# EAGLE design LCD&ControlRev2 (EAGLE 9.2.2)
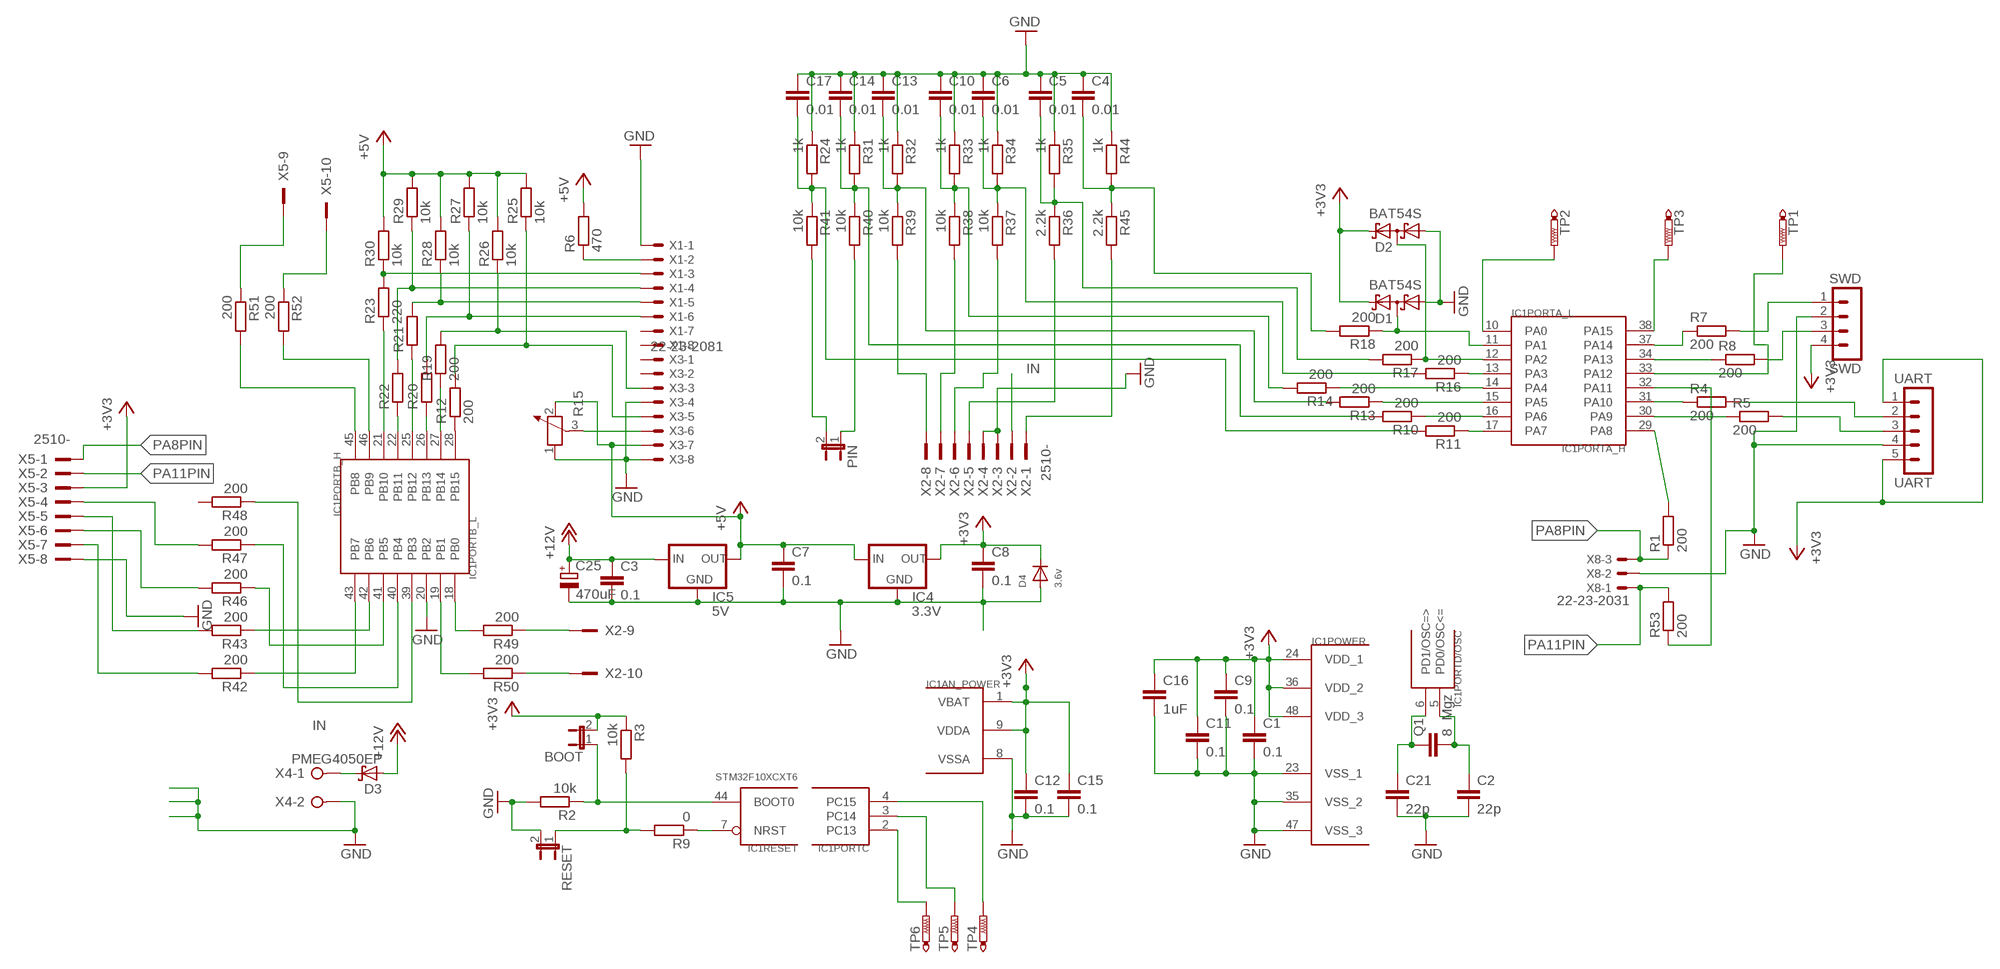
[diagram p0: schematic, sheet 1]

## Parts
BOOT  JP1E  [JP1]
C1  0.1  C-EUC0402  [C0402]
C2  22p  C-EUC0603  [C0603]
C3  0.1  C-EUC1206  [C1206]
C4  0.01  C-EUC0603  [C0603]
C5  0.01  C-EUC0603  [C0603]
C6  0.01  C-EUC0603  [C0603]
C7  0.1  C-EUC1206  [C1206]
C8  0.1  C-EUC1206  [C1206]
C9  0.1  C-EUC0402  [C0402]
C10  0.01  C-EUC0603  [C0603]
C11  0.1  C-EUC0402  [C0402]
C12  0.1  C-EUC0402  [C0402]
C13  0.01  C-EUC0603  [C0603]
C14  0.01  C-EUC0603  [C0603]
C15  0.1  C-EUC0402  [C0402]
C16  1uF  C-EUC0603  [C0603]
C17  0.01  C-EUC0603  [C0603]
C21  22p  C-EUC0603  [C0603]
C25  470uF  CPOL-EUE5-10.5  [E5-10,5]
D1  BAT54S  [SOT23]
D2  BAT54S  [SOT23]
D3  PMEG4050EP  [SOD128]
D4  3.6v  DIODESOD-123  [SOD-123]
IC1  STM32F10XCXT6  [TQFP48]
IC4  3.3V  LM1117  [SOT223]
IC5  5V  LM1117  [SOT223]
PIN  JP1E  [JP1]
Q1  8 Mgz  C-EU050-024X044  [C050-024X044]
R1  200  R-EU_R0603  [R0603]
R2  10k  R-EU_R0603  [R0603]
R3  10k  R-EU_R0603  [R0603]
R4  200  R-EU_R0603  [R0603]
R5  200  R-EU_R0603  [R0603]
R6  470  R-EU_R0603  [R0603]
R7  200  R-EU_R0603  [R0603]
R8  200  R-EU_R0603  [R0603]
R9  0  R-EU_M1206  [M1206]
R10  200  R-EU_R0603  [R0603]
R11  200  R-EU_R0603  [R0603]
R12  200  R-EU_R0603  [R0603]
R13  200  R-EU_R0603  [R0603]
R14  200  R-EU_R0603  [R0603]
R15  POTENTIOMETER_PT-10S  [PT-10S]
R16  200  R-EU_R0603  [R0603]
R17  200  R-EU_R0603  [R0603]
R18  200  R-EU_R0603  [R0603]
R19  200  R-EU_R0603  [R0603]
R20  R-EU_R0603  [R0603]
R21  R-EU_R0603  [R0603]
R22  R-EU_R0603  [R0603]
R23  220  R-EU_R0603  [R0603]
R24  1k  R-EU_R0603  [R0603]
R25  10k  R-EU_R0603  [R0603]
R26  10k  R-EU_R0603  [R0603]
R27  10k  R-EU_R0603  [R0603]
R28  10k  R-EU_R0603  [R0603]
R29  10k  R-EU_R0603  [R0603]
R30  10k  R-EU_R0603  [R0603]
R31  1k  R-EU_R0603  [R0603]
R32  1k  R-EU_R0603  [R0603]
R33  1k  R-EU_R0603  [R0603]
R34  1k  R-EU_R0603  [R0603]
R35  1k  R-EU_R0603  [R0603]
R36  2.2k  R-EU_R0603  [R0603]
R37  10k  R-EU_R0603  [R0603]
R38  10k  R-EU_R0603  [R0603]
R39  10k  R-EU_R0603  [R0603]
R40  10k  R-EU_R0603  [R0603]
R41  10k  R-EU_R0603  [R0603]
R42  200  R-EU_R0603  [R0603]
R43  200  R-EU_R0603  [R0603]
R44  1k  R-EU_R0603  [R0603]
R45  2.2k  R-EU_R0603  [R0603]
R46  200  R-EU_R0603  [R0603]
R47  200  R-EU_R0603  [R0603]
R48  200  R-EU_R0603  [R0603]
R49  200  R-EU_R0603  [R0603]
R50  200  R-EU_R0603  [R0603]
R51  200  R-EU_R0603  [R0603]
R52  200  R-EU_R0603  [R0603]
R53  200  R-EU_R0603  [R0603]
RESET  JP1E  [JP1]
SWD  SWD  MA04-1  [MA04-1]
TP1  PTR1TP06R  [TP06R]
TP2  PTR1TP06R  [TP06R]
TP3  PTR1TP06R  [TP06R]
TP4  PTR1TP06R  [TP06R]
TP5  PTR1TP06R  [TP06R]
TP6  PTR1TP06R  [TP06R]
UART  UART  MA05-1  [MA05-1]
X1  22-23-2081  [22-23-2081]
X2  2510-  [PAK100/2500-10]
X3  22-23-2081  [22-23-2081]
X4  W237-02P  [W237-132]
X5  2510-  [PAK100/2500-10]
X8  22-23-2031  [22-23-2031]

## Nets
+3V3: BOOT.2 C1.1 C8.1 C9.1 C11.1 C12.1 C15.1 C16.1 D1.2(C2) D2.2(C2) D4.C IC1.1(AN_POWER:VBAT) IC1.9(AN_POWER:VDDA) IC1.24(POWER:VDD_1) IC1.36(POWER:VDD_2) IC1.48(POWER:VDD_3) IC4.2(OUT) IC4.4(OUT) R3.1 SWD.4 UART.1 UART.5 X5.3
+5V: C7.1 IC4.3(IN) IC5.2(OUT) IC5.4(OUT) R6.2 R15.2 R25.2 R26.2 R27.2 R28.2 R29.2 R30.2 X3.7
+12V: C3.1 C25.+ D3.2(A) IC5.3(IN)
GND: C1.2 C2.2 C3.2 C4.1 C5.1 C6.1 C7.2 C8.2 C9.2 C10.1 C11.2 C12.2 C13.1 C14.1 C15.2 C16.2 C17.1 C21.2 C25.- D1.1(A1) D2.1(A1) D4.A IC1.8(AN_POWER:VSSA) IC1.20(PORTB_L:PB2) IC1.23(POWER:VSS_1) IC1.35(POWER:VSS_2) IC1.47(POWER:VSS_3) IC4.1(GND) IC5.1(GND) R2.2 R15.1 R24.1 R31.1 R32.1 R33.1 R34.1 R35.1 R44.1 RESET.2 SWD.2 UART.4 X1.1 X2.3 X2.4 X3.4 X3.8 X4.2 X5.8 X8.2
IN: D3.1(K) X2.2 X4.1
N$1: IC1.29(PORTA_H:PA8) R1.2
N$3: C21.1 IC1.6(PORTD/OSC:PD1/OSC=>) Q1.1
N$4: C2.1 IC1.5(PORTD/OSC:PD0/OSC<=) Q1.2
N$5: IC1.37(PORTA_H:PA14) R7.1
N$6: IC1.34(PORTA_H:PA13) R8.1
N$7: R7.2 SWD.1
N$8: R3.2 R9.2 RESET.1
N$9: IC1.7(RESET:NRST) R9.1
N$10: IC1.31(PORTA_H:PA10) R4.1
N$11: IC1.30(PORTA_H:PA9) R5.1
N$12: R4.2 UART.2
N$13: R6.1 X1.2
N$17: R15.3 X3.6
N$21: R49.1 X2.9
N$22: R22.2 R29.1 X1.4
N$23: C17.2 R11.2 R24.2 R41.1
N$24: R52.1 X5.10
N$26: IC1.33(PORTA_H:PA12) TP1.TP
N$27: IC1.46(PORTB_H:PB9) R52.2
N$29: R43.2 X5.5
N$30: R21.2 R28.1 X1.5
N$31: D1.3(C1A2) IC1.11(PORTA_L:PA1) R18.1
N$32: R20.2 R27.1 X1.6
N$33: R19.2 R26.1 X3.3
N$34: R23.2 R30.1 X1.3
N$35: R12.2 R25.1 X3.5
N$36: IC1.21(PORTB_H:PB10) R23.1
N$37: IC1.22(PORTB_H:PB11) R22.1
N$38: IC1.25(PORTB_H:PB12) R21.1
N$44: IC1.45(PORTB_H:PB8) R51.2
N$67: IC1.10(PORTA_L:PA0) TP2.TP
N$69: R5.2 UART.3
N$73: R46.2 X5.6
N$78: R47.2 X5.4
N$79: R51.1 X5.9
N$105: IC1.28(PORTB_H:PB15) R12.1
N$107: R8.2 SWD.3
N$109: IC1.18(PORTB_L:PB0) R49.2
N$112: IC1.43(PORTB_L:PB7) R42.1
N$113: D2.3(C1A2) IC1.12(PORTA_L:PA2) R17.1
N$115: BOOT.1 IC1.44(RESET:BOOT0) R2.1
N$117: R42.2 X5.7
N$123: IC1.42(PORTB_L:PB6) R43.1
N$127: C14.2 R10.2 R31.2 R40.1
N$129: C13.2 R13.2 R32.2 R39.1
N$130: R38.2 X2.7
N$131: IC1.13(PORTA_L:PA3) R16.1
N$132: IC1.19(PORTB_L:PB1) R50.2
N$134: IC1.14(PORTA_L:PA4) R14.1
N$135: C6.2 R16.2 R34.2 R37.1
N$138: C5.2 R17.2 R35.2 R36.1
N$140: IC1.26(PORTB_H:PB13) R20.1
N$141: IC1.27(PORTB_H:PB14) R19.1
N$142: R50.1 X2.10
N$143: IC1.38(PORTA_H:PA15) TP3.TP
N$160: IC1.15(PORTA_L:PA5) R13.1
N$162: IC1.16(PORTA_L:PA6) R10.1
N$164: R45.2 X2.1
N$165: IC1.41(PORTB_L:PB5) R46.1
N$169: IC1.17(PORTA_L:PA7) R11.1
N$170: IC1.2(PORTC:PC13) TP6.TP
N$171: IC1.40(PORTB_L:PB4) R47.1
N$172: IC1.39(PORTB_L:PB3) R48.1
N$173: C4.2 R18.2 R44.2 R45.1
N$174: R36.2 X2.5
N$175: R37.2 X2.6
N$176: IC1.3(PORTC:PC14) TP5.TP
N$177: IC1.32(PORTA_H:PA11) R53.1
N$178: C10.2 R14.2 R33.2 R38.1
N$179: R39.2 X2.8
N$180: IC1.4(PORTC:PC15) TP4.TP
N$184: PIN.1 R40.2
N$199: PIN.2 R41.2
PA8PIN: R1.1 X5.1 X8.3
PA11PIN: R53.2 X5.2 X8.1
Unconnected: R48.2 X1.7 X1.8 X3.1 X3.2

## Library data of the parts
BOOT PIN RESET = jumper:JP1E: JUMPER
C1-C3 C7-C9 C11 C12 C15 C16 C21 Q1 = rcl:C-EU: CAPACITOR, European symbol
C4-C6 C10 C13 C14 C17 = rcl:C-EU: CAPACITOR, European symbol; SPICEPREFIX: C
C25 = rcl:CPOL-EU: POLARIZED CAPACITOR, European symbol
D1 D2 = diode:BAT54S: Schottky Diodes Pin connection corrected 2011-05-04 Source: Fairchild .. BAT54.pdf
D3 = nxp_60:PMEG4050E: 40 V, 5 A low VF MEGA Schottky barrier rectifier Planar Maximum Efficiency General Application (MEGA) Schottky barrier rectifier with an integrated guard ring for stress protection. AAL Eindhoven MK
D4 = adafruit:DIODE: Diode SMADIODE - SMA Surface Mount Package 20V 1A Schottky Diode Digikey: 641-1014-6-ND DO-1N4148 - Through Hole Small Current Diode SOD-123 20V 1 A (.5mV Vf) Schottky Diode - Digikey: MBRX120TPMSCT-ND SOD-323 10V 570mA (.38mV Vf, 3ns) Schottky Diode - Digikey: ZLLS410CT-ND SOD-523 30V 30mA Schottky Diode (RB751S-40TE61) - Digikey: RB751S-40TE61CT-ND SOT23-R/W - SOT23 Package (R = Solder Paste/Reflow Ovens, W = Hand-Soldering) BAT54Film 40V 300mA - Digikey: 497-7162-1-ND
IC1 = stm32(1):STM32F10XCXT6: ST STM32F101/103 48pin LQFP
IC4 IC5 = v-reg-2:LM1117
R1-R14 R16-R34 R36-R53 = rcl:R-EU_: RESISTOR, European symbol
R15 = rcl:POTENTIOMETER_: Potentiometer
R35 = rcl:R-EU_: RESISTOR, European symbol; SPICEPREFIX: R
SWD = con-lstb:MA04-1: PIN HEADER; OC_FARNELL: unknown; OC_NEWARK: unknown
TP1-TP6 = testpad:PTR1: TEST PIN
UART = con-lstb:MA05-1: PIN HEADER; OC_FARNELL: unknown; OC_NEWARK: unknown
X1 X3 = con-molex:22-23-2081: .100" (2.54mm) Center Header - 8 Pin; MF: MOLEX; MPN: 22-23-2081; OC_FARNELL: 1756826; OC_NEWARK: 01C7592
X2 X5 = con-3m:2510-: 3M (TM) Pak 100 4-Wall Header Source: 3M; MF: 3M; MPN: 2510-6002UB; OC_FARNELL: 9838244; OC_NEWARK: 46F4725
X4 = con-wago-508:W237-02P: WAGO SREW CLAMP; OC_FARNELL: unknown; OC_NEWARK: unknown
X8 = con-molex:22-23-2031: .100" (2.54mm) Center Header - 3 Pin; MF: MOLEX; MPN: 22-23-2031; OC_FARNELL: 1462950; OC_NEWARK: 30C0862

## Board
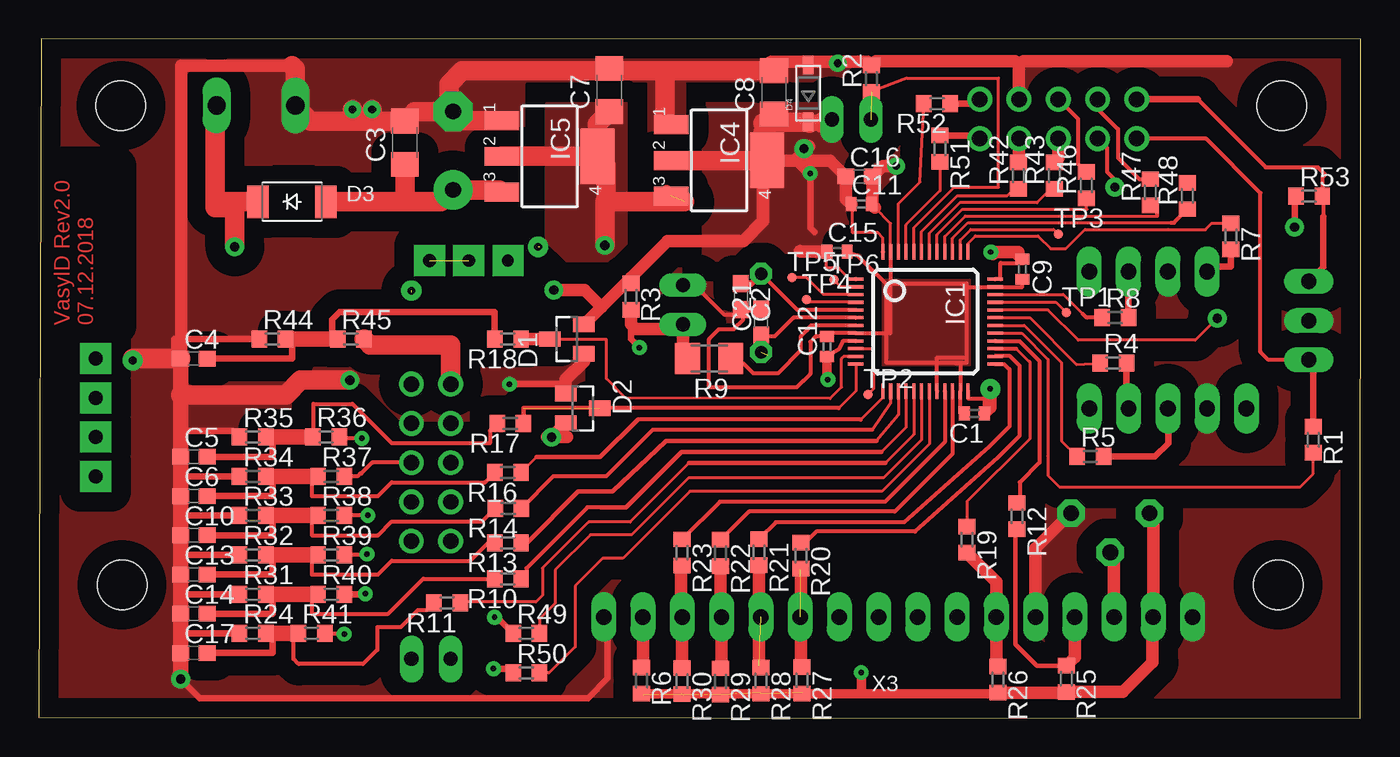
[diagram p1: board, top side]
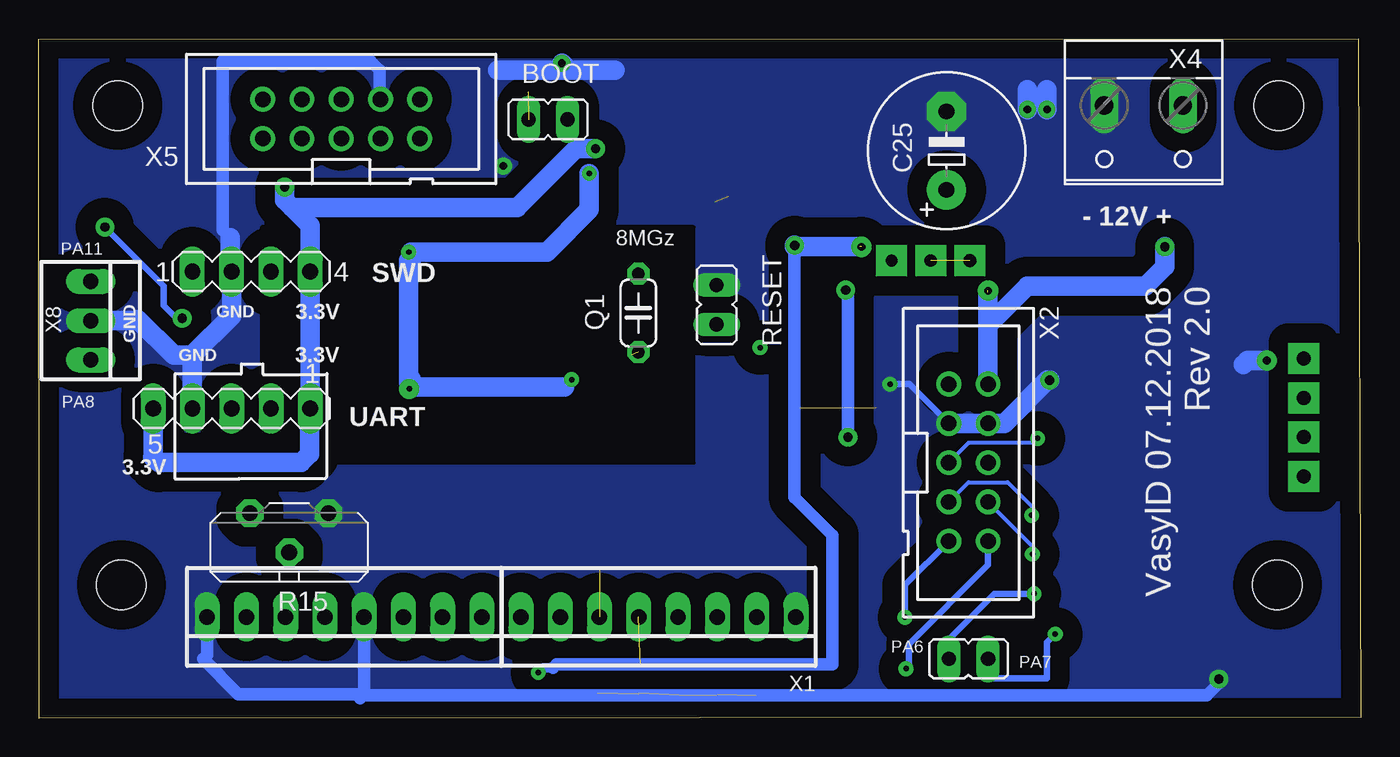
[diagram p2: board, bottom side, seen from below]

Size 85.55 x 43.99 mm. Coordinates in mm from the lower left corner, seen from the top.
Outline: 0,0.06 85.51,0 85.55,43.96 0.17,43.99 0,0.06
Copper layers (1*16): Top 0.035mm / dielectric 1.5mm / Bottom 0.035mm
Design rules "DRC LCD part *": minimum track width 7mil, minimum drill 0.35mm, track to track 9mil, track to pad 10mil, pad to pad 12mil, via to via 12mil, smd to smd 2mil, copper to edge 40mil, drill to drill 40mil, minimum pad ring 12mil, minimum via ring 12mil, stop-mask expansion 4mil, vias tented up to drill 0mil, thermal gap 10mil
Holes 3.2 mm at 5.4,8.64 5.32,39.65 80.44,39.66 80.2,8.64

### Footprints (pad centres in the part's own frame; a part is rotated, then mirrored left to right if it is on the bottom)
JP1 = drill 0.914 long: 1 0,-1.27; 2 0,1.27
C0402 = smd 0.7 x 0.9: 1 -0.65,0; 2 0.65,0
C0603 = smd 1.1 x 1: 1 -0.85,0; 2 0.85,0
C1206 = smd 1.6 x 1.8: 1 -1.4,0; 2 1.4,0
E5-10,5 = drill 1.016 pad 2.54: + -2.54,0 | drill 1.016 pad 2.54 octagon: - 2.54,0
SOT23 = smd 1 x 1.4: 1 -0.95,-1.1; 2 0.95,-1.1; 3 0,1.1
SOD128 = smd 1.4 x 2.1: 1 -2.2,0; 2 2.2,0
SOD-123 = smd 1.2 x 0.7: A 1.85,0; C -1.85,0
TQFP48 = smd 0.2 x 1: 1 -2.75,-4.5; 2 -2.25,-4.5; 3 -1.75,-4.5; 4 -1.25,-4.5; 5 -0.75,-4.5; 6 -0.25,-4.5; 7 0.25,-4.5; 8 0.75,-4.5; 9 1.25,-4.5; 10 1.75,-4.5; 11 2.25,-4.5; 12 2.75,-4.5; 25 2.75,4.5; 26 2.25,4.5; 27 1.75,4.5; 28 1.25,4.5; 29 0.75,4.5; 30 0.25,4.5; 31 -0.25,4.5; 32 -0.75,4.5; 33 -1.25,4.5; 34 -1.75,4.5; 35 -2.25,4.5; 36 -2.75,4.5 | smd 1 x 0.2: 13 4.5,-2.75; 14 4.5,-2.25; 15 4.5,-1.75; 16 4.5,-1.25; 17 4.5,-0.75; 18 4.5,-0.25; 19 4.5,0.25; 20 4.5,0.75; 21 4.5,1.25; 22 4.5,1.75; 23 4.5,2.25; 24 4.5,2.75; 37 -4.5,2.75; 38 -4.5,2.25; 39 -4.5,1.75; 40 -4.5,1.25; 41 -4.5,0.75; 42 -4.5,0.25; 43 -4.5,-0.25; 44 -4.5,-0.75; 45 -4.5,-1.25; 46 -4.5,-1.75; 47 -4.5,-2.25; 48 -4.5,-2.75
SOT223 = smd 1.219 x 2.235: 1 -2.311,-3.099; 2 0,-3.099; 3 2.311,-3.099 | smd 3.6 x 2.2: 4 0,3.099
C050-024X044 = drill 0.813 octagon: 1 -2.54,0; 2 2.54,0
R0603 = smd 1 x 1.1: 1 -0.85,0; 2 0.85,0
M1206 = smd 1.6 x 2: 1 -1.4,0; 2 1.4,0
PT-10S = drill 1.016 pad 1.778 octagon: 1 -2.54,-1.27; 2 2.54,-1.27; 3 0,1.27
MA04-1 = drill 1.016 long: 1 -3.81,0; 2 -1.27,0; 3 1.27,0; 4 3.81,0
TP06R = smd 0.6 x 0.6: TP 0,0
MA05-1 = drill 1.016 long: 1 -5.08,0; 2 -2.54,0; 3 0,0; 4 2.54,0; 5 5.08,0
22-23-2081 = drill 1 long: 1 -8.89,0; 2 -6.35,0; 3 -3.81,0; 4 -1.27,0; 5 1.27,0; 6 3.81,0; 7 6.35,0; 8 8.89,0
PAK100/2500-10 = drill 1 pad 1.422: 1 -5.08,-1.27; 2 -5.08,1.27; 3 -2.54,-1.27; 4 -2.54,1.27; 5 0,-1.27; 6 0,1.27; 7 2.54,-1.27; 8 2.54,1.27; 9 5.08,-1.27; 10 5.08,1.27
W237-132 = drill 1.194 long: 1 -2.54,-0.635; 2 2.54,-0.635
22-23-2031 = drill 1 long: 1 -2.54,0; 2 0,0; 3 2.54,0

### Placement (x,y rotation side)
BOOT  52.59,38.76 270 bottom
C1  60.55,19.74 180 top
C2  45.43,27.3 270 top
C3  23.7,37.25 90 top
C4  10.05,23.28 0 top
C5  10.05,16.93 0 top
C6  10.05,14.39 0 top
C7  36.92,40.67 90 top
C8  47.57,40.51 90 top
C9  63.65,29.07 270 top
C10  10.05,11.85 0 top
C11  53.23,33.27 0 top
C12  51,24.06 90 top
C13  10.05,9.31 0 top
C14  10.05,6.77 0 top
C15  51.66,30.2 0 top
C16  53.1,35.06 0 top
C17  10.05,4.23 0 top
C21  46.75,25.65 90 top
C25  26.81,36.74 90 bottom
D1  34.18,24.55 90 top
D2  35.2,20.07 270 top
D3  16.4,33.44 0 top
D4  49.8,40.45 90 top
IC1  57.38,25.68 270 top
IC4  44.03,36.11 270 top
IC5  33.06,36.37 270 top
PIN  25.39,3.85 270 bottom
Q1  46.75,26.24 90 bottom
R1  82.47,18.03 270 top
R2  53.89,41.4 90 top
R3  38.32,27.29 270 top
R4  69.53,23.01 0 top
R5  68.05,16.94 0 top
R6  39.01,2.45 270 top
R7  77.15,31.19 270 top
R8  69.66,25.95 0 top
R9  43.38,23.28 180 top
R10  30.37,9.03 180 top
R11  26.43,7.47 180 top
R12  63.31,13.09 270 top
R13  30.37,11.37 180 top
R14  30.39,13.6 180 top
R15  69.34,12.01 180 bottom
R16  30.37,15.91 180 top
R17  30.52,19.09 180 top
R18  30.37,24.55 180 top
R19  60.07,11.57 270 top
R20  49.31,10.53 270 top
R21  46.62,10.76 270 top
R22  44.13,10.71 270 top
R23  41.64,10.73 270 top
R24  13.86,5.5 0 top
R25  66.5,2.57 270 top
R26  62.08,2.51 270 top
R27  49.4,2.46 270 top
R28  46.75,2.44 270 top
R29  44.13,2.39 270 top
R30  41.63,2.41 270 top
R31  13.86,8.04 0 top
R32  13.86,10.58 0 top
R33  13.86,13.12 0 top
R34  13.86,15.66 0 top
R35  13.86,18.2 0 top
R36  18.61,18.22 0 top
R37  18.94,15.66 0 top
R38  18.94,13.12 0 top
R39  18.94,10.58 0 top
R40  18.94,8.04 0 top
R41  17.67,5.5 0 top
R42  63.39,35.13 90 top
R43  65.71,35.13 90 top
R44  15.13,24.55 0 top
R45  20.21,24.55 0 top
R46  67.78,34.51 90 top
R47  71.95,34.05 90 top
R48  74.33,33.81 90 top
R49  31.56,5.5 0 top
R50  31.56,2.93 0 top
R51  58.33,36.87 270 top
R52  58.13,39.79 180 top
R53  82.21,33.79 0 top
RESET  41.68,26.77 0 bottom
SWD  71.79,28.92 0 bottom
TP1  66.48,26.25 0 top
TP2  53.66,20.97 0 top
TP3  65.98,31.36 0 top
TP4  49.67,27.11 0 top
TP5  48.73,28.54 0 top
TP6  51.47,28.38 0 top
UART  73.06,20.05 180 bottom
X1  45.45,6.57 180 bottom
X2  25.39,16.55 270 bottom
X3  65.77,6.57 180 bottom
X4  14.06,39.03 180 bottom
X5  65.98,38.8 0 bottom
X8  82.18,25.74 270 bottom

### Tracks (layer width: path | path; a pad name or v marks a point on that pad's centre or on a via)
+3V3  (via drill 0.35, 0.35 pad 1.3, 0.6)
  Top 0.203: IC1.48 54.63,31.1 54.29,31.43 52.67,31.43 52.67,33.18 C11.1 | IC1.1 52.47,28.43 51.75,29.15 50.97,29.15 50.97,30.15 C15.1
  Top 0.254: IC1.24 60.14,21.18 60.14,20.71 61.2,20.71 C1.1 | IC1.36 62.24,28.43 62.24,29.48 63.65,29.48 C9.1 | IC1.48 | 52.87,28.44 IC1.1 | 52.88,24.41 IC1.9 52.86,24.41 52.03,24.41 51.78,23.9 C12.1 | X5.3 69.13,36.92 69.13,35.37 69.69,34.81 69.69,34.43 v69.63,34.38 | SWD.4 67.98,30.34
  Top 0.406: v61.61,30.18 61.74,30.04 61.75,30.04 | 50.2,31.46 49.92,31.74 v49.92,35.27
  Top 0.61: 49.09,36.11 48.15,36.11 | C12.1 51,21.98 v51.07,21.92
  Top 0.813: C1.1 61.57,20.11 v61.57,21.32 | 49.99,38.41 D4.C | 35.45,25.67 arc-90 D1.2 36.41,26.63 | D2.2 v33.19,18.2 | v33.19,18.2 32.91,18.2 | v33.19,18.2 34.18,18.2 | C11.1 52.25,33.6 C16.1 51.21,36.11 49.09,36.11 v49.92,35.27 | 48.15,36.11 IC4.4 48.91,36.11 49.85,37.05 49.7,37.05 v49.52,36.87 | 36.41,26.63 38.32,28.54 | 38.32,28.54 40.68,30.9 45.61,30.9 46.88,32.17 46.88,35.98 | v33.34,27.72 35.32,27.72 36.41,26.63 | R3.1 38.32,28.54 | C9.1 63.4,29.97 63.4,30.19 61.89,30.19 61.74,30.04 | C15.1 49.3,30.2 49.26,30.24
  Top 1.27: 46.91,37.96 46.88,37.92 47.13,37.67 IC4.4 IC4.2 | 50.69,38.58 50.69,38.52 | 49.88,38.52 D4.C 46.96,38.6 46.88,38.52
  Bottom 0.406: v61.57,21.32 61.76,21.51 61.61,21.73 | 61.44,29.4 61.61,29.57 61.61,29.63
  Bottom 0.813: v51.07,21.92 51.54,21.45 | v33.19,18.2 33.19,27.57 v33.34,27.72 | 61.53,21.88 61.53,21.45 61.53,21.36 v61.57,21.32 | v61.61,30.18 61.61,29.63
  Bottom 1.27: 51.54,21.45 61.53,21.45 | 61.44,21.97 61.53,21.88 | 61.44,29.4 61.44,30.19 52.67,30.19 49.92,32.93 v49.92,35.27 | 61.61,29.63 61.61,21.73 | v49.52,36.87 50.79,36.87 54.6,33.06 69.15,33.06 | 69.63,34.33 v69.63,34.38 69.63,33.54 69.15,33.06 | 69.15,33.06 67.98,31.89 SWD.4 UART.1 68.01,20.03 68.01,17.11 68.57,16.55 77.79,16.55 78.14,16.9 | 78.14,16.9 78.17,16.93 | UART.5 78.14,16.9
  pour Top (isolate 1.27, no thermals): 43.07,39.79 55.77,39.79 55.77,29.63 43.07,29.63
+5V  (via drill 0.35, 0.5 pad 1.3, 0.6)  (6 unrouted)
  Top 0.61: 64.66,1.67 64.59,1.6 53.23,1.6 | R6.2 53.23,1.6 | 53.23,1.6 v53.23,2.96
  Top 0.813: 41.71,1.49 R30.2 | 46.7,1.64 R28.2 | 49.38,1.64 R27.2 | R26.2 64.66,1.67 66.45,1.67 R25.2 70.17,1.72 72.07,3.62 72.07,6.52 X3.7 72.12,13.04 R15.2 | 39.13,1.49 R6.2 | IC4.3 40.61,34.11
  Top 1.27: IC5.2 IC5.4 | IC5.4 36.16,38.5 C7.1 | IC5.4 36.72,35.81 36.72,33.44 | 36.72,33.44 36.64,33.44 v36.64,30.62 | 36.72,33.44 41.8,33.44
  Bottom 0.61: v53.23,2.96 52.92,3.26 52.26,3.26
  Bottom 0.813: v36.64,30.62 36.64,14.31 34.18,11.85 34.18,3.49 52.03,3.49 52.26,3.26
  Bottom 1.27: v36.64,30.62 36.64,30.52 32.41,30.52
  other vias: 32.32,30.52
  pour Top (isolate 1.27, no thermals): 32.91,39.79 37.99,39.79 37.99,29.63 34.18,29.63 32.91,30.9
+12V
  Top 1.27: D3.2 23.51,33.44 | 23.51,33.44 26.05,33.44 C25.+ 29.82,34.2 IC5.3 | C3.1 23.7,33.63 23.51,33.44
GND  (via drill 0.35, 0.5, 0.5 pad 1.3, 0.6)
  Top 0.203: IC1.47 55.13,32.02 54.1,33.05 C11.2
  Top 0.254: IC1.47 55.13,28.17 55.22,28.17 55.22,28.14 60.05,28.14 60.05,27.93 | 60.05,27.93 60.05,23.34 | 60.05,23.34 60.05,23.01 59.64,23.01 | 59.33,23.01 54.86,23.01 54.86,24.87 | 54.86,24.87 54.86,28.09 | 54.86,28.09 55.09,28.09 55.09,24.93 | 60.05,27.93 IC1.35 63.65,27.93 C9.2 | 59.56,23.01 59.33,23.01 | 59.33,23.01 59.33,22.99 59.56,22.99 59.56,23.01 | 59.56,23.01 59.64,23.01 | 59.64,23.01 59.64,21.18 IC1.23 59.63,19.74 C1.2 | IC1.20 58.13,23.34 60.05,23.34 | IC1.47 | IC1.47 | 54.86,24.87 54.8,24.93 IC1.8 51.05,24.93 C12.2 50.28,24.71 49.93,24.37 49.93,22.29 49.5,21.86 49.47,21.86 49.03,21.43 43.38,21.43 43.38,24.55 44.02,25.18 44.97,25.18 45.61,25.82 45.61,26.28 C2.2 45.12,26.14 44.34,26.14 42.43,28.04 | C15.2 53,29.96 54.86,28.09 | 54.22,35.41 C16.2
  Top 0.406: R31.1 9.2,8.04 | R24.1 9.2,5.5 | R32.1 9.2,10.58 | R44.1 8.78,24.55 8.78,23.7 C4.1 | v9.2,2.54 10.43,1.31 35.55,1.31 36.82,2.58 36.82,6.31 X1.1 | R35.1 12.6,18.61 9.2,18.61 | R34.1 9.22,15.66 9.2,15.63 | R33.1 9.32,13.12 9.2,13.25 | v30.47,21.63 34.1,21.63 | C2.2 46.69,26.45 C21.2 | RESET.2 42.43,28.04
  Top 0.61: C16.2 53.88,34.99
  Top 0.813: 16.4,42.26 9.21,42.23 9.21,23.29 C4.1 | D1.1 35.28,23.11 34.1,21.94 34.1,21.63 D2.1 | C8.2 47.57,42.24 47.36,42.46 47.41,42.51 52.06,42.51 | 52.06,42.51 53.63,42.51 R2.2 54.18,42.54 63.16,42.54 63.44,42.26 | 54.1,33.05 53.95,33.2 C16.2 54.63,35.75 v55.49,35.75 | X3.4 64.5,10.99 R15.1 | 63.44,42.26 X5.8 | 63.44,42.26 63.71,42.54 66.03,42.54 | 66.03,42.54 66.13,42.54 | 66.03,42.54 76.87,42.54 | 52.06,42.51 51.95,42.4 v51.7,42.4
  Top 1.016: C4.1 9.2,20.94 9.2,18.61 9.2,15.63 9.2,13.25 9.2,10.58 9.2,8.04 9.2,5.5 C17.1 v9.2,2.54
  Top 1.27: 47.53,41.87 C8.2 40.53,41.91 | C7.2 36.94,42.09 | 40.53,41.91 27.41,41.91 26.56,41.06 26.56,39.54 C25.- | IC4.1 40.53,38.82 40.53,41.91 | v20.13,21.88 16.95,21.88 16.01,20.94 9.2,20.94 | IC5.1 27.41,38.68 C25.- | C25.- 24.33,39.28 C3.2 21.58,38.65 | 21.58,38.65 20.31,38.65 | 20.31,38.65 17.61,38.65 X4.2 16.6,42.05 16.4,42.26 | 20.31,38.65 v20.31,39.41 | 21.58,38.65 v21.58,39.41 | C4.1 6.08,23.28 v6.08,23.15
  Bottom 0.406: X2.3 29.2,21.63 v30.47,21.63
  Bottom 0.813: X5.8 63.49,40.12 63.49,41.95 64.08,42.54 73.65,42.54 73.65,31.79 | 73.65,31.79 | 73.65,31.79 73.65,31.61 73.16,31.13 | v9.2,2.54 9.2,2.26 9.98,1.48 10.15,1.48 64.59,1.48 | 64.59,1.48 64.76,1.31 | 64.59,1.48 64.5,1.56 | 64.5,1.56 X3.4 | 64.5,1.56 72.63,1.56 74.92,3.85 74.66,4.1 X3.8 | v51.7,42.4 52.06,42.04 52.06,41.95
  Bottom 1.27: X2.3 X2.4 23.08,19.09 20.28,21.88 v20.13,21.88 | 73.16,31.13 73.16,29.02 SWD.2 73.06,26.05 75.6,23.51 | X8.2 79.21,25.74 79.13,25.82 76.82,23.51 75.6,23.51 | v20.31,39.41 20.31,40.68 | v21.58,39.41 21.58,40.68 | 75.6,23.51 UART.4 | 6.08,23.2 v6.08,23.15 7.35,23.15 7.61,22.9 | v51.7,42.4 51.25,41.95 | 51.25,41.95 48.25,41.95 | 51.25,41.95 55.87,41.95
  pour Top (isolate 0.406, rank 2, no thermals): 54.62,28.36 60.26,28.36 60.26,22.87 54.62,22.87
  pour Top (isolate 1.27, rank 3, no thermals): -0.11,43.6 84.98,43.6 84.98,0.42 -0.11,0.42
  pour Bottom (isolate 1.27, rank 2, no thermals): 0.42,43.98 0.42,43.98 85.59,44.13 85.43,0.04 0.14,0.19 0.14,44.13 0.23,44.08
IN  (via drill 0.5 pad 1.3, 0.6)  (1 unrouted)
  Top 1.27: v12.69,30.52 12.69,33.34 | 12.69,33.34 12.59,33.44 | X4.1 11.42,39.56 11.42,33.06 | D3.1 11.8,33.44 11.42,33.06 | 11.42,33.06 12.41,33.06 12.69,33.34
  Bottom 1.27: X2.2 24.12,25.44 | 24.12,25.44 21.58,27.98 13.96,27.98 12.69,29.25 v12.69,30.52 | 24.12,25.44 24.12,27.59
  other vias: 24.12,27.67
N$1
  Top 0.203: IC1.29 63.62,24.93 65.32,23.23 65.32,16.98 | 65.32,16.98 65.29,16.95 | 65.32,16.98 65.32,15.71 66.04,14.99 81.64,14.99 82.47,15.82 R1.2
N$3  (1 unrouted)
  Top 0.254: IC1.6 48.84,25.93 47.63,24.71 46.84,24.71 C21.1 | 47.19,23.51 47.26,23.45
  Top 0.406: C21.1 Q1.1
N$4
  Top 0.254: IC1.5 49.1,26.43 Q1.2
  Top 0.406: C2.1 46.12,28.15 Q1.2
N$5
  Top 0.203: R7.1 75.91,32.04 75.49,31.62 | 75.48,31.61 75.49,31.62 | IC1.37 60.13,30.74 60.6,31.22 60.62,31.22 64.67,31.22 65.49,30.39 66.46,30.39 67.7,31.64 73.08,31.64 73.09,31.62 75.49,31.62
N$6
  Top 0.203: IC1.34 66.3,27.43 67.55,26.18 67.83,25.9
  Top 0.254: R8.1 67.78,25.95 67.55,26.18
N$7
  Top 0.406: SWD.1 75.93,29.25 77.15,29.25 R7.2
N$8  (via drill 0.35)
  Top 0.254: 41.68,23.17 41.48,22.96 41.67,22.96 R9.2
  Top 0.406: 38.32,25.51 38.32,24.55 v38.87,23.99
  Top 0.813: R9.2 41.68,23.58 41.68,25.03 | 41.68,25.03 RESET.1 | R3.2 38.32,25.51 38.65,25.18 41.53,25.18 41.68,25.03
  Bottom 0.406: v38.87,23.99 39.05,24.17
N$9
  Top 0.254: IC1.7 49.98,25.43 49.73,25.18 49.73,25.13 49.68,25.07 49.66,25.07 49.3,24.71 49.3,23.79 47.83,22.33 46.24,22.33 45.61,22.96 45.1,22.96 R9.1
N$10
  Top 0.203: IC1.31 64.14,25.93 67.16,22.91 R4.1
N$11
  Top 0.203: IC1.30 63.78,25.43 66.18,23.03 66.18,17.96 R5.1
N$12
  Top 0.406: 70.55,22.85 R4.2 70.38,20.19 UART.2
N$13
  Top 0.813: X1.2 39.1,3.39 R6.1
N$15  (via drill 0.8 pad 2, 0.85 pad 2)  (1 unrouted)
  other vias: 27.83,29.63 25.29,29.63
N$17
  Top 0.813: X3.6 69.58,10.5 R15.3
N$21  (via drill 0.35)
  Top 0.406: R49.1 29.67,6.54 v29.5,6.54
  Bottom 0.406: v29.5,6.54 29.5,8.62 X2.9
N$22
  Top 0.813: 44.18,9.81 R22.2 44.13,6.62 X1.4 44.18,3.29 R29.1
N$23
  Top 0.254: 16.4,5.5 16.42,5.5 16.5,5.42 16.5,3.85 16.8,3.54 | R11.2 25.11,7 24.52,7 23.43,5.91 21.91,5.91 21.91,4.43 20.99,3.52 20.97,3.54 16.8,3.54 | 16.83,3.52 16.8,3.54
  Top 0.406: C17.2 15.13,4.23 15.13,5.5
  Top 0.813: R41.1 16.42,5.5
  Top 1.016: R24.2 15.13,5.5 16.42,5.5
N$24
  Top 0.406: R52.1 60.62,39.79 X5.10
N$26
  Top 0.203: IC1.33 65.81,26.93 TP1.TP
N$27
  Top 0.203: IC1.46 55.63,33.3 57.04,34.71 R52.2
N$29
  Top 0.813: R43.2 65.98,36.25 X5.5
N$30  (1 unrouted)
  Top 0.813: 46.72,9.81 R21.2 46.62,3.42 R28.1 46.72,3.31
N$31
  Top 0.203: IC1.11 52.11,23.43 51.96,23.28 51.96,21.44 51.21,20.69 37.99,20.74 36.74,21.98 36.74,24.52 32.45,24.52 32.42,24.55
  Top 0.813: D1.3 32.42,24.55 R18.1
N$32  (1 unrouted)
  Top 0.813: 49.26,9.63 R20.2 49.31,3.5 49.26,3.45 R27.1
N$33
  Top 0.813: R19.2 61.96,8.83 X3.3 61.96,3.48 R26.1
N$34
  Top 0.813: R30.1 41.64,3.28 X1.3 41.57,6.64 41.57,9.81 R23.2
N$35
  Top 0.305: R25.1 64.58,3.42 63.21,4.79 63.21,12.14 R12.2
  Top 0.813: X3.5 67.04,3.96 R25.1
N$36
  Top 0.254: IC1.21 58.63,17.89 54.76,14.02 44.08,14.02 R23.1
N$37
  Top 0.254: IC1.22 59.13,17.12 55.4,13.39 45.96,13.39 R22.1
N$38
  Top 0.254: IC1.25 62.47,22.93 62.81,22.58 62.81,18.9 61.48,17.56 55.99,12.69 47.7,12.69 R21.1
N$44
  Top 0.203: IC1.45 56.13,31.95 58.33,34.15 R51.2
N$67
  Top 0.203: IC1.10 53.92,23.93 54.01,23.84 54.01,21.32 TP2.TP
N$69
  Top 0.406: R5.2 72.24,16.94 73.09,17.79 73.09,20.03 UART.3
N$73
  Top 0.254: X5.6 67.25,38.8 67.25,35.89 R46.2
N$78
  Top 0.254: X5.4 68.52,39.46 69.84,38.14 69.84,36.28 71.22,34.9 R47.2
N$79
  Top 0.406: R51.1 60.71,37.72 X5.9
N$105
  Top 0.254: IC1.28 61.9,24.41 63.46,24.41 64.76,23.11 64.76,16.55 63.49,15.28 63.49,14.12 R12.1
N$107
  Top 0.406: R8.2 70.51,28.9 SWD.3
N$109
  Top 0.203: IC1.18 57.13,18.03 54.67,15.57 42.06,15.57 38.37,11.87 35.7,11.87 33.43,9.6 33.43,7.44 32.41,6.43 R49.2
N$112
  Top 0.203: R42.1 63.13,34.28 62.66,33.81 59.42,33.81 57.13,31.52 IC1.43
N$113  (1 unrouted)
  Top 0.203: IC1.12 52.88,21.18 51.78,20.08
  Top 0.254: 51.78,20.08 31.37,20.08
  Top 0.305: R17.1 31.37,20.08
N$115  (1 unrouted)
  Top 0.203: IC1.44 56.63,31.76 59.25,34.38 62.12,34.38 62.12,41.44 56.18,41.44 R2.1
N$117
  Top 0.813: R42.2 63.44,36.03 X5.7
N$123
  Top 0.203: R43.1 65.51,34.28 64.61,33.38 59.6,33.38 57.63,31.41 IC1.42
N$127
  Top 0.254: R40.1 17.67,8.04 17.67,6.77 22.62,6.77 24.88,9.03 R10.2
  Top 0.406: C14.2 15.13,6.77 15.13,8.04
  Top 1.016: R40.1 15.13,8.04 R31.2
N$129
  Top 0.254: R39.1 17.67,10.16 17.67,9.31 21.96,9.31 22.85,10.2 27.93,10.2 29.1,11.37 R13.2
  Top 0.406: C13.2 15.13,9.31 15.13,10.58
  Top 1.016: R39.1 15.13,10.58 R32.2
N$130  (via drill 0.35)
  Top 0.254: v21.3,13.14 19.81,13.14 R38.2
  Bottom 0.254: X2.7 25.39,15.28 22.85,15.28 21.3,13.73 v21.3,13.14
N$131
  Top 0.203: 54.63,21 IC1.13 54.63,20.77 53.2,19.34 | 32.21,16.9 R16.1
  Top 0.254: 53.2,19.34 38.77,19.34
  Top 0.305: 38.77,19.34 36.33,16.9 32.21,16.9
N$132
  Top 0.203: IC1.19 57.63,17.75 54.57,14.69 42.14,14.69 37.81,10.36 36.5,10.36 34.71,8.57 34.71,4.62 33.02,2.93 R50.2
N$134
  Top 0.203: IC1.14 55.13,20.39 53.95,18.67 | 31.34,13.7 R14.1
  Top 0.254: R14.1 33.3,15.66 36.72,15.66 39.73,18.67 53.95,18.67
N$135
  Top 0.254: R37.1 17.67,15.24 17.67,14.39 21.96,14.39 22.85,15.28 28.88,15.28 R16.2
  Top 0.406: C6.2 15.13,14.39 15.13,15.66
  Top 1.016: R37.1 15.13,15.66 R34.2
N$138
  Top 0.254: 17.67,18.2 17.77,18.2 R36.1 17.77,20.36 20.31,20.36 22.85,17.82 29.2,17.82 29.2,18.62 R17.2
  Top 0.406: C5.2 15.13,16.93 15.13,18.2
  Top 1.016: R36.1 | 17.77,18.2 15.13,18.2 R35.2
N$140
  Top 0.254: R20.1 49.61,11.38 50.32,12.09 56.71,12.09 62.12,16.93 63.49,18.3 63.49,22.81 62.86,23.44 IC1.26
N$141
  Top 0.203: 63.25,23.93 64.07,23.1 64.12,23.1 64.12,18.1 60.07,14.05 R19.1
  Top 0.254: IC1.27 63.25,23.93
N$142  (via drill 0.35)
  Top 0.406: R50.1 30.43,3.21 v29.43,3.21
  Bottom 0.406: v29.43,3.21 29.25,3.39 29.25,4.79 24.12,9.92 X2.10
N$143
  Top 0.203: IC1.38 59.63,30.96 60.31,31.65 65.68,31.65 TP3.TP
N$160
  Top 0.203: IC1.15 55.63,19.62 54.19,17.96
  Top 0.305: 54.19,17.96 40.58,17.96 37.15,14.68 34.91,14.68 31.6,11.37 R13.1
N$162
  Top 0.203: IC1.16 56.13,18.84 54.52,17.23
  Top 0.254: 36.72,13.67 35.51,13.67 31.56,9.72 31.56,9.37 R10.1
  Top 0.305: 36.37,13.67 36.72,13.67 38.01,13.67 41.58,17.23 54.52,17.23
N$164
  Top 1.27: R45.2 21.44,24.17 26.66,24.17 X2.1
N$165
  Top 0.203: R46.1 67.78,33 67.83,32.94 59.78,32.94 58.13,31.3 IC1.41
N$169
  Top 0.203: IC1.17 56.63,18.38 54.79,16.54 | 42.09,16.54 38.27,12.71 35.59,12.71 32.6,9.73 32.6,7.95 32.18,7.53 27.28,7.53 R11.1
  Top 0.305: 54.79,16.54 42.09,16.54
N$170
  Top 0.203: IC1.2 51.93,27.93 TP6.TP
N$171
  Top 0.203: 72.38,32.51 59.96,32.51 58.63,31.19 IC1.40
  Top 0.254: 72.38,32.51 72.38,32.77 R47.1
N$172
  Top 0.203: IC1.39 59.13,31.07 60.13,32.08 73.28,32.08
  Top 0.254: 73.28,32.08 73.46,32.08 R48.1
N$173
  Top 0.254: 18.94,24.13 R45.1
  Top 0.406: C4.2 16.4,23.28 16.4,24.55 | R18.2 29.52,26.29 29.5,26.3 27.93,26.3 19.47,26.3 18.99,25.82 18.99,24.83 18.71,24.55
  Top 1.016: R44.2 16.4,24.55 18.71,24.55 R45.1
N$174  (via drill 0.35)
  Top 0.254: v20.92,18.12 19.56,18.12 R36.2
  Bottom 0.254: v20.92,18.12 21.2,17.84 25.36,17.84 X2.5
N$175
  Top 0.254: X2.6 21.58,16.55 20.87,15.84 20.82,15.84 20.64,15.66 R37.2
N$176
  Top 0.203: IC1.3 50.78,27.43 49.67,28.54 TP5.TP
N$177  (via drill 0.6)
  Top 0.203: IC1.32 65.32,26.43 67.27,24.47 74.84,24.47 v76.26,25.9
  Top 0.406: R53.1 81.27,33.71 v81.27,31.79
  Bottom 0.406: v76.26,25.9 76.64,25.9 77.46,26.71 77.46,27.98 v81.27,31.79
N$178
  Top 0.254: R38.1 17.67,13.12 17.67,11.85 21.96,11.85 22.85,12.74 28.68,12.74 R14.2
  Top 0.406: C10.2 15.13,11.85 15.13,13.12
  Top 1.016: R38.1 15.13,13.12 R33.2
N$179  (via drill 0.35)
  Top 0.254: v21.25,10.63 21.2,10.58 R39.2
  Bottom 0.254: v21.25,10.63 21.25,11.14 X2.8
N$180
  Top 0.203: IC1.4 49.85,26.93 TP4.TP
N$183  (via drill 0.75 pad 2)
  other vias: 30.37,29.63
N$184  (via drill 0.35)
  Top 0.406: R40.2 21.12,8.04 v21.15,8.06
  Bottom 0.406: v21.15,8.06 23.71,8.06 26.66,5.12 PIN.1
N$199  (via drill 0.35)
  Top 0.254: R41.2 19.72,5.5 v19.77,5.45
  Bottom 0.254: 20.31,4.92 20.31,3.85
  Bottom 0.406: v19.77,5.45 20.31,4.92 20.31,2.58 24.12,2.58 PIN.2
N$201  (via drill 0.9 pad 2)
  other vias: 3.7,15.66
N$202  (via drill 0.9 pad 2)
  other vias: 3.7,18.2
N$203  (via drill 0.9 pad 2)
  other vias: 3.7,20.74
N$204  (via drill 0.9 pad 2)
  other vias: 3.7,23.28
NO
  cutout Bottom: 43.17,31.79 71.11,31.79 71.11,16.55 43.17,16.55
NO1
  cutout Top: 15.23,35.6 15.23,31.36 17.77,31.36 17.77,35.6
PA8PIN
  Top 0.254: X8.3 79.57,23.2 79.06,23.71 79.06,34 75.55,37.5 71.08,37.5 X5.1
  Top 0.406: R1.1 82.47,22.91 X8.3 82.49,22.9
PA11PIN
  Top 0.254: 74.99,40.07 79.39,35.67 82.77,35.67 83.25,35.19 83.06,35 R53.2 83.12,33.73 83.12,31.79
  Top 0.406: X5.2 74.99,40.07 | 83.12,32.47 83.12,31.79 83.12,29.22 X8.1

### Text on the board
Top: VasylD Rev2.0 / 07.12.2018
bNames: - 12V + | 8MGz | PA11 | VasylD 07.12.2018 / Rev 2.0 | GND | 3.3V | GND | 3.3V | GND | PA8 | 3.3V | PA6 | PA7